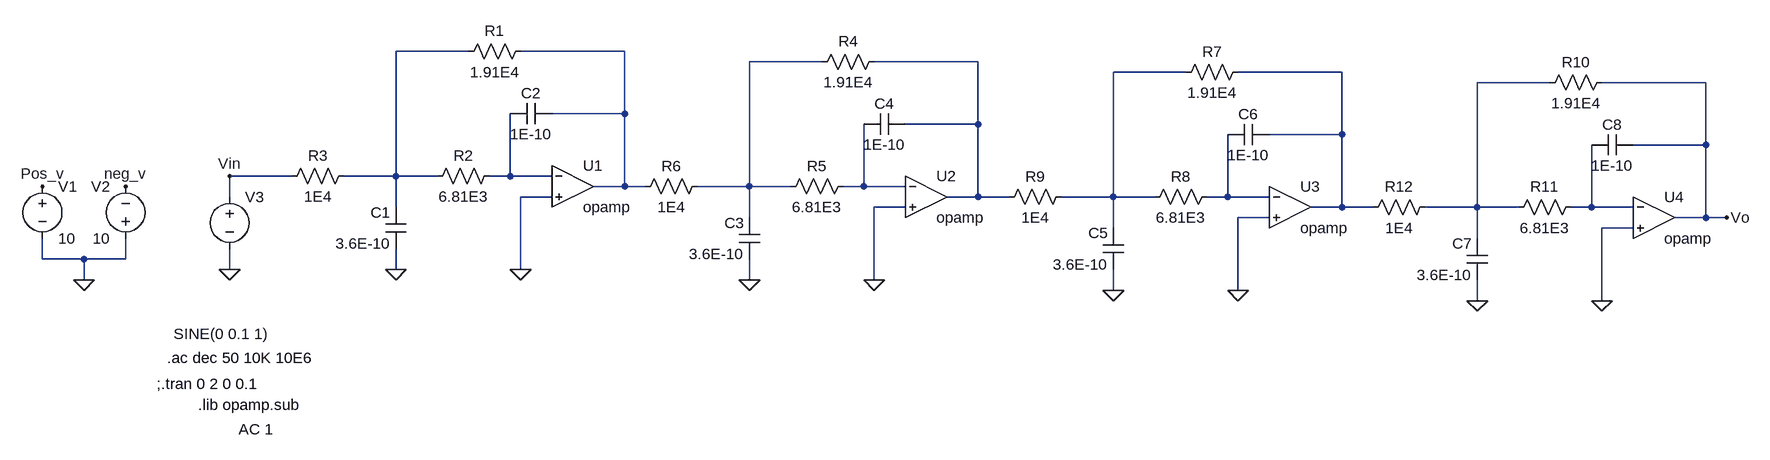
[diagram p0: schematic Cascade E96.asc]
Cascade E96.asc, the LTspice schematic file:
Version 4
SHEET 1 2208 680
WIRE 224 -192 112 -192
WIRE 464 -192 304 -192
WIRE 768 -176 656 -176
WIRE 1008 -176 848 -176
WIRE 1328 -160 1216 -160
WIRE 1568 -160 1408 -160
WIRE 1888 -144 1776 -144
WIRE 2128 -144 1968 -144
WIRE 464 -96 464 -192
WIRE 464 -96 352 -96
WIRE 1008 -80 1008 -176
WIRE 1008 -80 896 -80
WIRE 1568 -64 1568 -160
WIRE 1568 -64 1456 -64
WIRE 2128 -48 2128 -144
WIRE 2128 -48 2016 -48
WIRE -48 0 -144 0
WIRE 112 0 112 -192
WIRE 112 0 32 0
WIRE 176 0 112 0
WIRE 288 0 288 -96
WIRE 288 0 256 0
WIRE 352 0 288 0
WIRE 464 16 464 -96
WIRE 464 16 416 16
WIRE 496 16 464 16
WIRE 656 16 656 -176
WIRE 656 16 576 16
WIRE 720 16 656 16
WIRE 832 16 832 -80
WIRE 832 16 800 16
WIRE 896 16 832 16
WIRE -144 32 -144 0
WIRE 352 32 304 32
WIRE 1008 32 1008 -80
WIRE 1008 32 960 32
WIRE 1056 32 1008 32
WIRE 1216 32 1216 -160
WIRE 1216 32 1136 32
WIRE 1280 32 1216 32
WIRE 1392 32 1392 -64
WIRE 1392 32 1360 32
WIRE 1456 32 1392 32
WIRE 112 48 112 0
WIRE 896 48 848 48
WIRE 1568 48 1568 -64
WIRE 1568 48 1520 48
WIRE 1616 48 1568 48
WIRE 1776 48 1776 -144
WIRE 1776 48 1696 48
WIRE 1840 48 1776 48
WIRE 1952 48 1952 -48
WIRE 1952 48 1920 48
WIRE 2016 48 1952 48
WIRE 656 64 656 16
WIRE 1456 64 1408 64
WIRE 2128 64 2128 -48
WIRE 2128 64 2080 64
WIRE 2160 64 2128 64
WIRE 1216 80 1216 32
WIRE 2016 80 1968 80
WIRE 1776 96 1776 48
WIRE -432 128 -432 96
WIRE -368 128 -432 128
WIRE -304 128 -304 96
WIRE -304 128 -368 128
WIRE -144 144 -144 112
WIRE 112 144 112 112
WIRE 304 144 304 32
WIRE -368 160 -368 128
WIRE 656 160 656 128
WIRE 848 160 848 48
WIRE 1216 176 1216 144
WIRE 1408 176 1408 64
WIRE 1776 192 1776 160
WIRE 1968 192 1968 80
FLAG -432 16 Pos_v
FLAG -304 16 neg_v
FLAG -368 160 0
FLAG 304 144 0
FLAG 112 144 0
FLAG -144 144 0
FLAG -144 0 Vin
FLAG 848 160 0
FLAG 656 160 0
FLAG 1408 176 0
FLAG 1216 176 0
FLAG 1968 192 0
FLAG 1776 192 0
FLAG 2160 64 Vo
SYMBOL voltage -432 0 R0
WINDOW 123 0 0 Left 0
WINDOW 39 0 0 Left 0
SYMATTR InstName V1
SYMATTR Value 10
SYMBOL voltage -304 112 R180
WINDOW 0 24 96 Left 2
WINDOW 3 24 16 Left 2
SYMATTR InstName V2
SYMATTR Value 10
SYMBOL res 320 -208 R90
WINDOW 0 0 56 VBottom 2
WINDOW 3 32 56 VTop 2
SYMATTR InstName R1
SYMATTR Value 1.91E4
SYMBOL res 272 -16 R90
WINDOW 0 0 56 VBottom 2
WINDOW 3 32 56 VTop 2
SYMATTR InstName R2
SYMATTR Value 6.81E3
SYMBOL res 48 -16 R90
WINDOW 0 0 56 VBottom 2
WINDOW 3 32 56 VTop 2
SYMATTR InstName R3
SYMATTR Value 1E4
SYMBOL cap 128 112 R180
WINDOW 0 24 56 Left 2
WINDOW 3 24 8 Left 2
SYMATTR InstName C1
SYMATTR Value 3.6E-10
SYMBOL cap 288 -80 R270
WINDOW 0 32 32 VTop 2
WINDOW 3 0 32 VBottom 2
SYMATTR InstName C2
SYMATTR Value 1E-10
SYMBOL voltage -144 16 R0
WINDOW 123 14 374 Left 2
WINDOW 39 0 0 Left 0
WINDOW 3 -86 227 Left 2
SYMATTR Value2 AC 1
SYMATTR Value SINE(0 0.1 1)
SYMATTR InstName V3
SYMBOL res 864 -192 R90
WINDOW 0 0 56 VBottom 2
WINDOW 3 32 56 VTop 2
SYMATTR InstName R4
SYMATTR Value 1.91E4
SYMBOL res 816 0 R90
WINDOW 0 0 56 VBottom 2
WINDOW 3 32 56 VTop 2
SYMATTR InstName R5
SYMATTR Value 6.81E3
SYMBOL res 592 0 R90
WINDOW 0 0 56 VBottom 2
WINDOW 3 32 56 VTop 2
SYMATTR InstName R6
SYMATTR Value 1E4
SYMBOL cap 672 128 R180
WINDOW 0 24 56 Left 2
WINDOW 3 24 8 Left 2
SYMATTR InstName C3
SYMATTR Value 3.6E-10
SYMBOL cap 832 -64 R270
WINDOW 0 32 32 VTop 2
WINDOW 3 0 32 VBottom 2
SYMATTR InstName C4
SYMATTR Value 1E-10
SYMBOL res 1424 -176 R90
WINDOW 0 0 56 VBottom 2
WINDOW 3 32 56 VTop 2
SYMATTR InstName R7
SYMATTR Value 1.91E4
SYMBOL res 1376 16 R90
WINDOW 0 0 56 VBottom 2
WINDOW 3 32 56 VTop 2
SYMATTR InstName R8
SYMATTR Value 6.81E3
SYMBOL res 1152 16 R90
WINDOW 0 0 56 VBottom 2
WINDOW 3 32 56 VTop 2
SYMATTR InstName R9
SYMATTR Value 1E4
SYMBOL cap 1232 144 R180
WINDOW 0 24 56 Left 2
WINDOW 3 24 8 Left 2
SYMATTR InstName C5
SYMATTR Value 3.6E-10
SYMBOL cap 1392 -48 R270
WINDOW 0 32 32 VTop 2
WINDOW 3 0 32 VBottom 2
SYMATTR InstName C6
SYMATTR Value 1E-10
SYMBOL res 1984 -160 R90
WINDOW 0 0 56 VBottom 2
WINDOW 3 32 56 VTop 2
SYMATTR InstName R10
SYMATTR Value 1.91E4
SYMBOL res 1936 32 R90
WINDOW 0 0 56 VBottom 2
WINDOW 3 32 56 VTop 2
SYMATTR InstName R11
SYMATTR Value 6.81E3
SYMBOL res 1712 32 R90
WINDOW 0 0 56 VBottom 2
WINDOW 3 32 56 VTop 2
SYMATTR InstName R12
SYMATTR Value 1E4
SYMBOL cap 1792 160 R180
WINDOW 0 24 56 Left 2
WINDOW 3 24 8 Left 2
SYMATTR InstName C7
SYMATTR Value 3.6E-10
SYMBOL cap 1952 -32 R270
WINDOW 0 32 32 VTop 2
WINDOW 3 0 32 VBottom 2
SYMATTR InstName C8
SYMATTR Value 1E-10
SYMBOL Opamps\\opamp 384 -48 R0
SYMATTR InstName U1
SYMBOL Opamps\\opamp 928 -32 R0
SYMATTR InstName U2
SYMBOL Opamps\\opamp 1488 -16 R0
SYMATTR InstName U3
SYMBOL Opamps\\opamp 2048 0 R0
SYMATTR InstName U4
TEXT -240 280 Left 2 !.ac dec 50 10K 10E6
TEXT -256 320 Left 2 !;.tran 0 2 0 0.1
TEXT -192 352 Left 2 !.lib opamp.sub

The netlist it stands for:
* Cascade E96.asc
V1 Pos_v 0 10
V2 0 neg_v 10
R1 N002 N001 1.91E4
R2 N008 N001 6.81E3
R3 N001 Vin 1E4
C1 0 N001 3.6E-10
C2 N008 N002 1E-10
V3 Vin 0 SINE(0 0.1 1) AC 1
R4 N004 N003 1.91E4
R5 N009 N003 6.81E3
R6 N003 N002 1E4
C3 0 N003 3.6E-10
C4 N009 N004 1E-10
R7 N006 N005 1.91E4
R8 N010 N005 6.81E3
R9 N005 N004 1E4
C5 0 N005 3.6E-10
C6 N010 N006 1E-10
R10 Vo N007 1.91E4
R11 N011 N007 6.81E3
R12 N007 N006 1E4
C7 0 N007 3.6E-10
C8 N011 Vo 1E-10
XU1 N008 0 N002 opamp Aol=100K GBW=10Meg  ; pins invin noninvin out
XU2 N009 0 N004 opamp Aol=100K GBW=10Meg  ; pins invin noninvin out
XU3 N010 0 N006 opamp Aol=100K GBW=10Meg  ; pins invin noninvin out
XU4 N011 0 Vo opamp Aol=100K GBW=10Meg  ; pins invin noninvin out
.ac dec 50 10K 10E6
;.tran 0 2 0 0.1
.lib opamp.sub
.backanno
.end

* Results of the author's LTspice run, read from the files saved beside the schematic
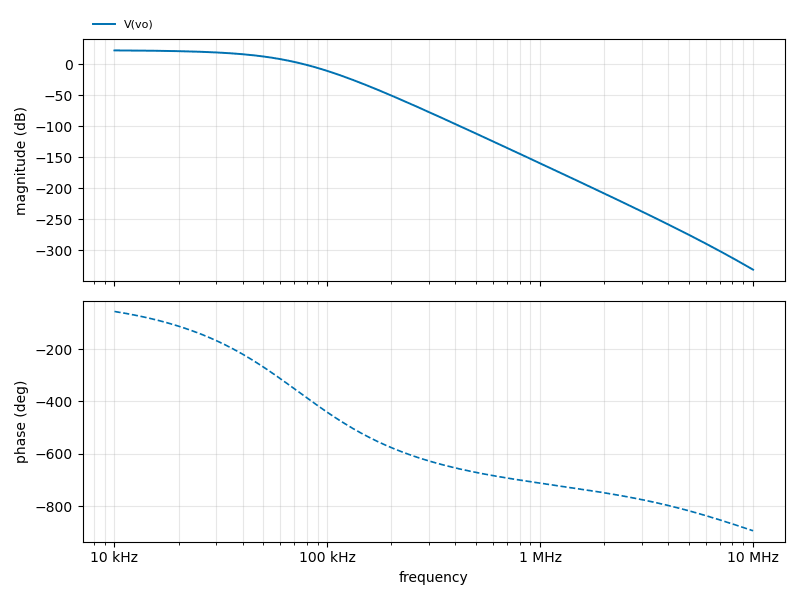
[diagram p1: AC Analysis of Cascade E96.asc, plotted from the saved traces]
* AC Analysis, 1 run:
*   V(vo): 22.08 dB at 10 kHz, -331.32 dB at 10 MHz, peak 22.08 dB at 10 kHz, 3 dB below the peak at 28.93 kHz